# Altium schematic sheet analog_sensor_input.SchDoc
size A
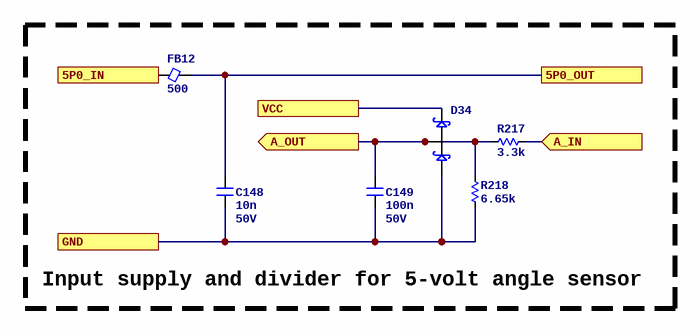
[diagram p0: analog_sensor_input.SchDoc]

## Parts
C148  Capacitance: 10n  Voltage Rating: 50V  [C0402]  (hidden comment: CL05B103KB5NNNC)
C149  Capacitance: 100n  Voltage Rating: 50V  [C0402]  (hidden comment: CL05B104KB54PNC)
D34  BAT54SLT1G  [3SOT23]  (value not drawn)
FB12  Current Rating (mA): 500  [FB0402]  (hidden comment: BLM15AX601SN1D)
R217  value 3.3k  [R0402]  (hidden comment: 0402WGF3301TCE)
R218  value 6.65k  [R0402]  (hidden comment: FRC0402F6651TS)

## Blocks framed on the sheet
Input supply and divider for 5-volt angle sensor: C148 C149 D34 FB12 R217 R218

## Ports
5P0_IN, 5P0_OUT, A_IN (in), A_OUT (out), GND, VCC

## Nets
5P0_IN: FB12.1 ; port 5P0_IN
5P0_OUT: C148.1 FB12.2 ; port 5P0_OUT
A_IN: R217.2 ; port A_IN
A_OUT: C149.1 D34.3 R217.1 R218.2 ; port A_OUT
GND: C148.2 C149.2 D34.1 R218.1 ; port GND
VCC: D34.2 ; port VCC

## Library data of the parts
C148 = CL05B103KB5NNNC: Manufacturer: Samsung Electro-Mechanics; Dielectric: X7R; ComponentLink1URL: https://wmsc.lcsc.com/wmsc/upload/file/pdf/v2/lcsc/2304140030_Samsung-Electro-Mechanics-CL05B103KB5NNNC_C15195.pdf; ComponentLink1Description: Datasheet; Manufacturer Part Number: CL05B103KB5NNNC; Package: 0402; Supplier 2: LCSC; Supplier Part Number 2: C15195
C149 = CL05B104KB54PNC: Manufacturer: Samsung Electro-Mechanics; Dielectric: X7R; ComponentLink1URL: https://wmsc.lcsc.com/wmsc/upload/file/pdf/v2/lcsc/2304140030_Samsung-Electro-Mechanics-CL05B104KB54PNC_C307331.pdf; ComponentLink1Description: Datasheet; Manufacturer Part Number: CL05B104KB54PNC; Package: 0402; Supplier 2: LCSC; Supplier Part Number 2: C307331
D34 = SCHOTTKY_30V_DUAL_BAT54SLT1G: DIODE SCHOTTKY DUAL 30V SOT23; Manufacturer: ON Semiconductor; Supplier 1: Digikey; Manufacturer Part Number: BAT54SLT1G; RoHS: RoHS Compliant; ComponentLink1URL: https://www.onsemi.com/pdf/datasheet/bat54slt1-d.pdf; ComponentLink1Description: Datasheet; Supplier Part Number 1: BAT54SLT1GOSCT-ND; Supplier 2: LCSC; Supplier Part Number 2: C19726
FB12 = BLM15AX601SN1D: Manufacturer: Murata Electronics; Z @ 100 MHz: 600; DCR (mOhms): 340; ComponentLink1URL: https://wmsc.lcsc.com/wmsc/upload/file/pdf/v2/lcsc/2304140030_Murata-Electronics-BLM15AX601SN1D_C76886.pdf; ComponentLink1Description: Datasheet; Manufacturer Part Number: BLM15AX601SN1D; Supplier 2: LCSC; Supplier Part Number 2: C76886; Package: 0402
R217 = 0402WGF3301TCE: Manufacturer: UNI-ROYAL(Uniroyal Elec); Tolerance: 1%; Temperature Coefficient: Â±100ppm/â„ƒ; Power Rating (mW): 62.5; ComponentLink1Description: Datasheet; ComponentLink1URL: https://wmsc.lcsc.com/wmsc/upload/file/pdf/v2/lcsc/2206010045_UNI-ROYAL-Uniroyal-Elec-0402WGF3301TCE_C25890.pdf; Manufacturer Part Number: 0402WGF3301TCE; Package: 0402; Supplier 2: LCSC; Supplier Part Number 2: C25890
R218 = FRC0402F6651TS: Manufacturer: FOJAN; Tolerance: 1%; Temperature Coefficient: Â±100ppm/â„ƒ; Power Rating (mW): 62.5; ComponentLink1Description: Datasheet; ComponentLink1URL: https://datasheet.lcsc.com/lcsc/2308241947_FOJAN-FRC0402F6651TS_C2998056.pdf; Manufacturer Part Number: FRC0402F6651TS; Package: 0402; Supplier 2: LCSC; Supplier Part Number 2: C2998056